# Altium schematic sheet MCU.SchDoc: SmartCoin
size A4; Date: 22.06.2025; Author: Vamsi Krishna Sesham; Revision: A; SheetNumber: 2; SheetTotal: 5
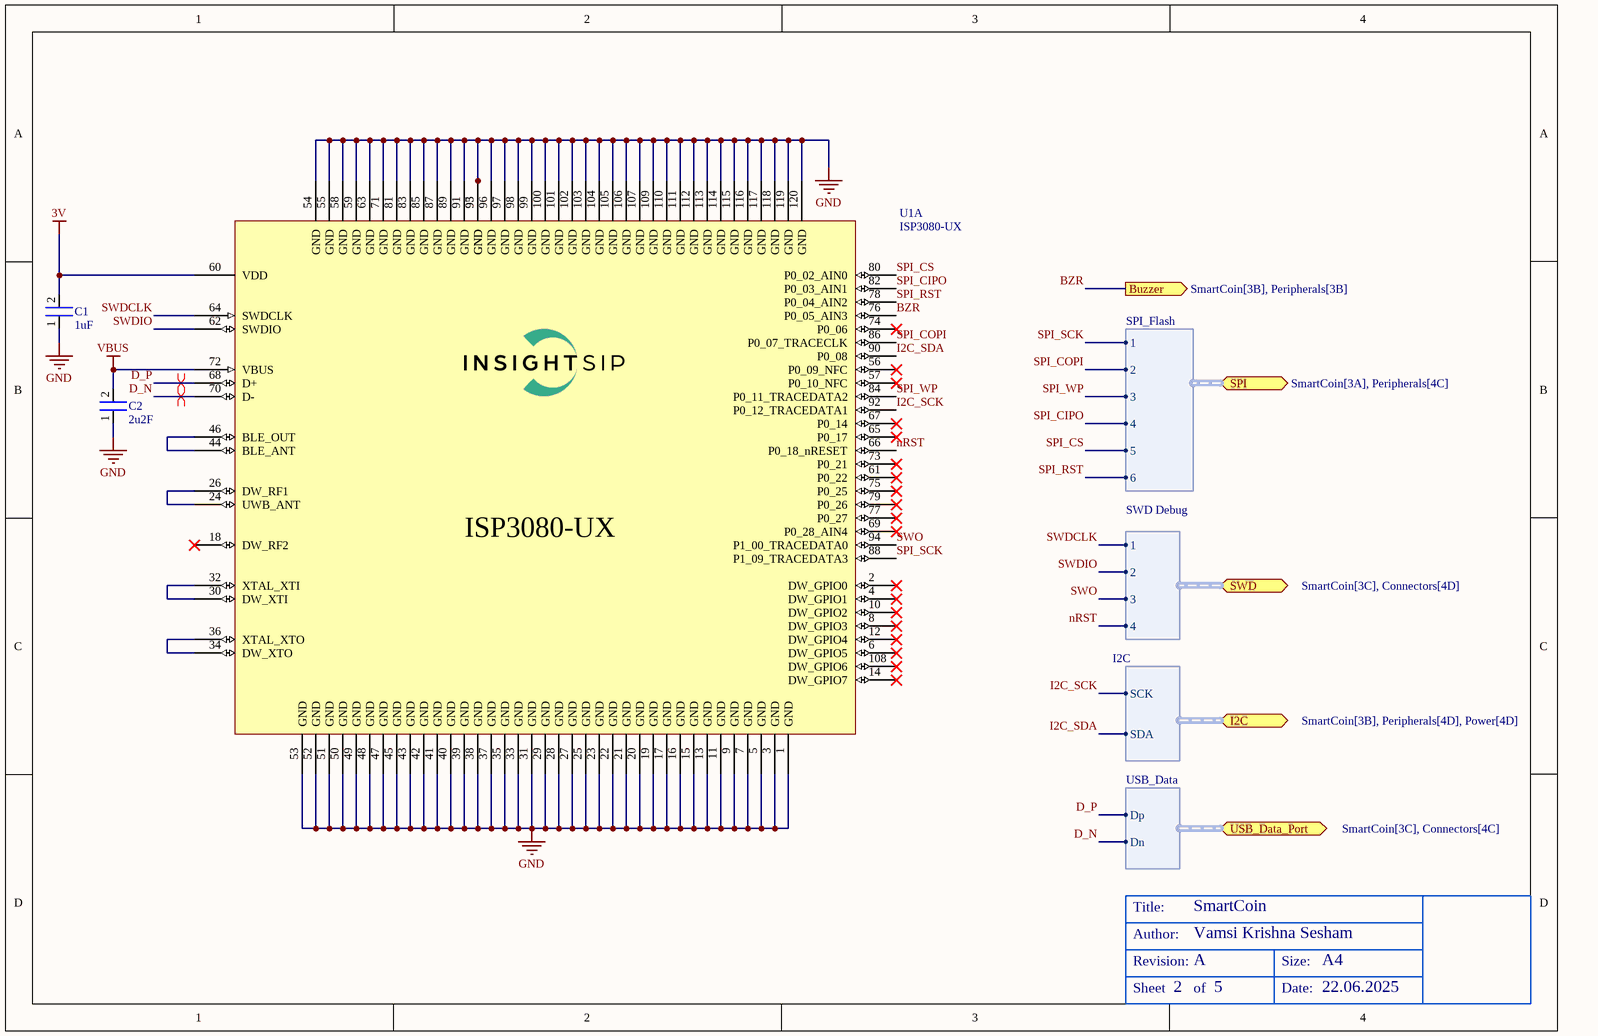
[diagram p0: MCU.SchDoc]

## Parts
*  TitleBlock  (value not drawn)  (graphical)
C1  1uF  [Capacitor - 0201]
C2  2u2F  [Capacitor - 0201]
U1  ISP3080-UX  [ISP3080-UX]  (part A of 2)

## Ports
Buzzer (out, see SmartCoin[3B], Peripherals[3B]), I2C (bidir, harness I2C, see SmartCoin[3B], Peripherals[4D], Power[4D]), SPI (bidir, harness SPI_Flash, see SmartCoin[3A], Peripherals[4C]), SWD (bidir, harness SWD Debug, see SmartCoin[3C], Connectors[4D]), USB_Data_Port (bidir, harness USB_Data, see SmartCoin[3C], Connectors[4C])

## Harnesses
USB_Data: Dp, Dn
I2C: SCK, SDA
SWD Debug: 1, 2, 3, 4
SPI_Flash: 1, 2, 3, 4, 5, 6

## Nets
3V: C1.2 U1.60(VDD)
GND: C1.1 C2.1 U1.1(GND) U1.3(GND) U1.5(GND) U1.7(GND) U1.9(GND) U1.11(GND) U1.13(GND) U1.15(GND) U1.16(GND) U1.17(GND) U1.19(GND) U1.20(GND) U1.21(GND) U1.22(GND) U1.23(GND) U1.25(GND) U1.27(GND) U1.28(GND) U1.29(GND) U1.31(GND) U1.33(GND) U1.35(GND) U1.37(GND) U1.38(GND) U1.39(GND) U1.40(GND) U1.41(GND) U1.42(GND) U1.43(GND) U1.45(GND) U1.47(GND) U1.48(GND) U1.49(GND) U1.50(GND) U1.51(GND) U1.52(GND) U1.53(GND) U1.54(GND) U1.55(GND) U1.58(GND) U1.59(GND) U1.63(GND) U1.71(GND) U1.81(GND) U1.83(GND) U1.85(GND) U1.87(GND) U1.89(GND) U1.91(GND) U1.93(GND) U1.95(GND) U1.96(GND) U1.97(GND) U1.98(GND) U1.99(GND) U1.100(GND) U1.101(GND) U1.102(GND) U1.103(GND) U1.104(GND) U1.105(GND) U1.106(GND) U1.107(GND) U1.109(GND) U1.110(GND) U1.111(GND) U1.112(GND) U1.113(GND) U1.114(GND) U1.115(GND) U1.116(GND) U1.117(GND) U1.118(GND) U1.119(GND) U1.120(GND)
VBUS: C2.2 U1.72(VBUS)
BZR: U1.76(P0_05_AIN3) ; port Buzzer
D_N: U1.70(D-) ; port USB_Data_Port.Dn
D_P: U1.68(D+) ; port USB_Data_Port.Dp
I2C_SCK: U1.92(P0_12_TRACEDATA1) ; port I2C.SCK
I2C_SDA: U1.90(P0_08) ; port I2C.SDA
nRST: U1.66(P0_18_nRESET) ; port SWD.4
SPI_CIPO: U1.82(P0_03_AIN1) ; port SPI.4
SPI_COPI: U1.86(P0_07_TRACECLK) ; port SPI.2
SPI_CS: U1.80(P0_02_AIN0) ; port SPI.5
SPI_RST: U1.78(P0_04_AIN2) ; port SPI.6
SPI_SCK: U1.88(P1_09_TRACEDATA3) ; port SPI.1
SPI_WP: U1.84(P0_11_TRACEDATA2) ; port SPI.3
SWDCLK: U1.64(SWDCLK) ; port SWD.1
SWDIO: U1.62(SWDIO) ; port SWD.2
SWO: U1.94(P1_00_TRACEDATA0) ; port SWD.3
NetU1_24: U1.24(UWB_ANT) U1.26(DW_RF1)
NetU1_30: U1.30(DW_XTI) U1.32(XTAL_XTI)
NetU1_34: U1.34(DW_XTO) U1.36(XTAL_XTO)
NetU1_44: U1.44(BLE_ANT) U1.46(BLE_OUT)

Not connected (* = marked no-connect by the designer): U1 2(DW_GPIO0)* 4(DW_GPIO1)* 6(DW_GPIO5)* 8(DW_GPIO3)* 10(DW_GPIO2)* 12(DW_GPIO4)* 14(DW_GPIO7)* 18(DW_RF2)* 56(P0_09_NFC)* 57(P0_10_NFC)* 61(P0_22)* 65(P0_17)* 67(P0_14)* 69(P0_28_AIN4)* 73(P0_21)* 74(P0_06)* 75(P0_25)* 77(P0_27)* 79(P0_26)* 108(DW_GPIO6)*

## Layout directives
differential pair: D_N, D_P

## Notes on the sheet
- (in symbol TitleBlock) Title:; Author:; Revision:; Size:; A4; Sheet; of; Date:

## Library data of the parts
C1 C2 = Capacitor - 0201
U1 = CMP-006-000000-2: BLE & UWB module (Revision C); Source: ISP3080C.SchLib; Design Item ID: ISP3080-UX